# EAGLE schematic PCB_eLock_G592_J1 (EAGLE 6.2)
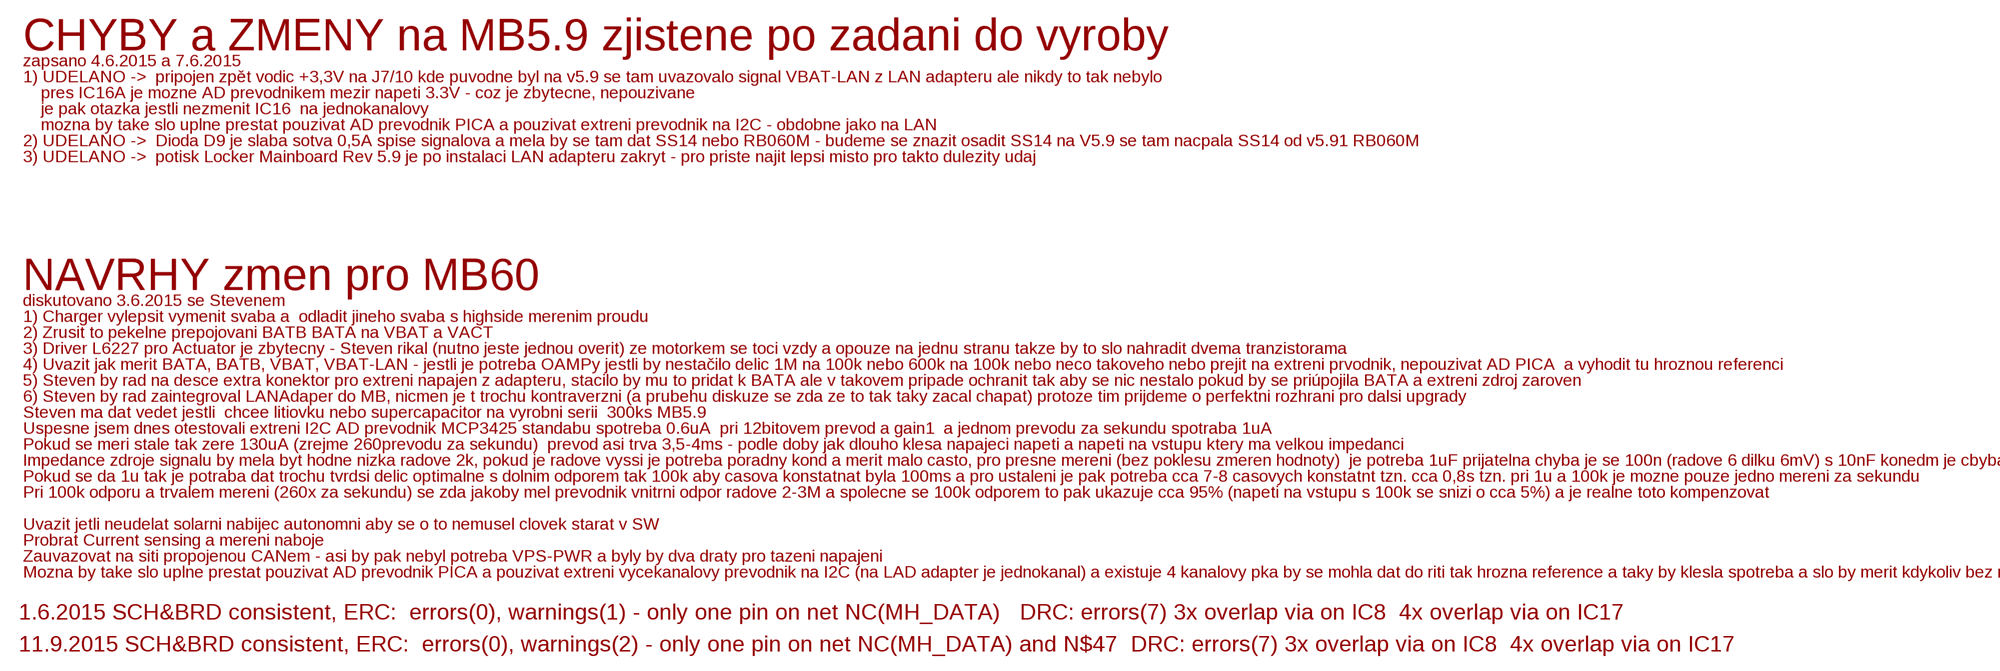
[diagram p0: schematic, sheet 1, part 1 of 3]
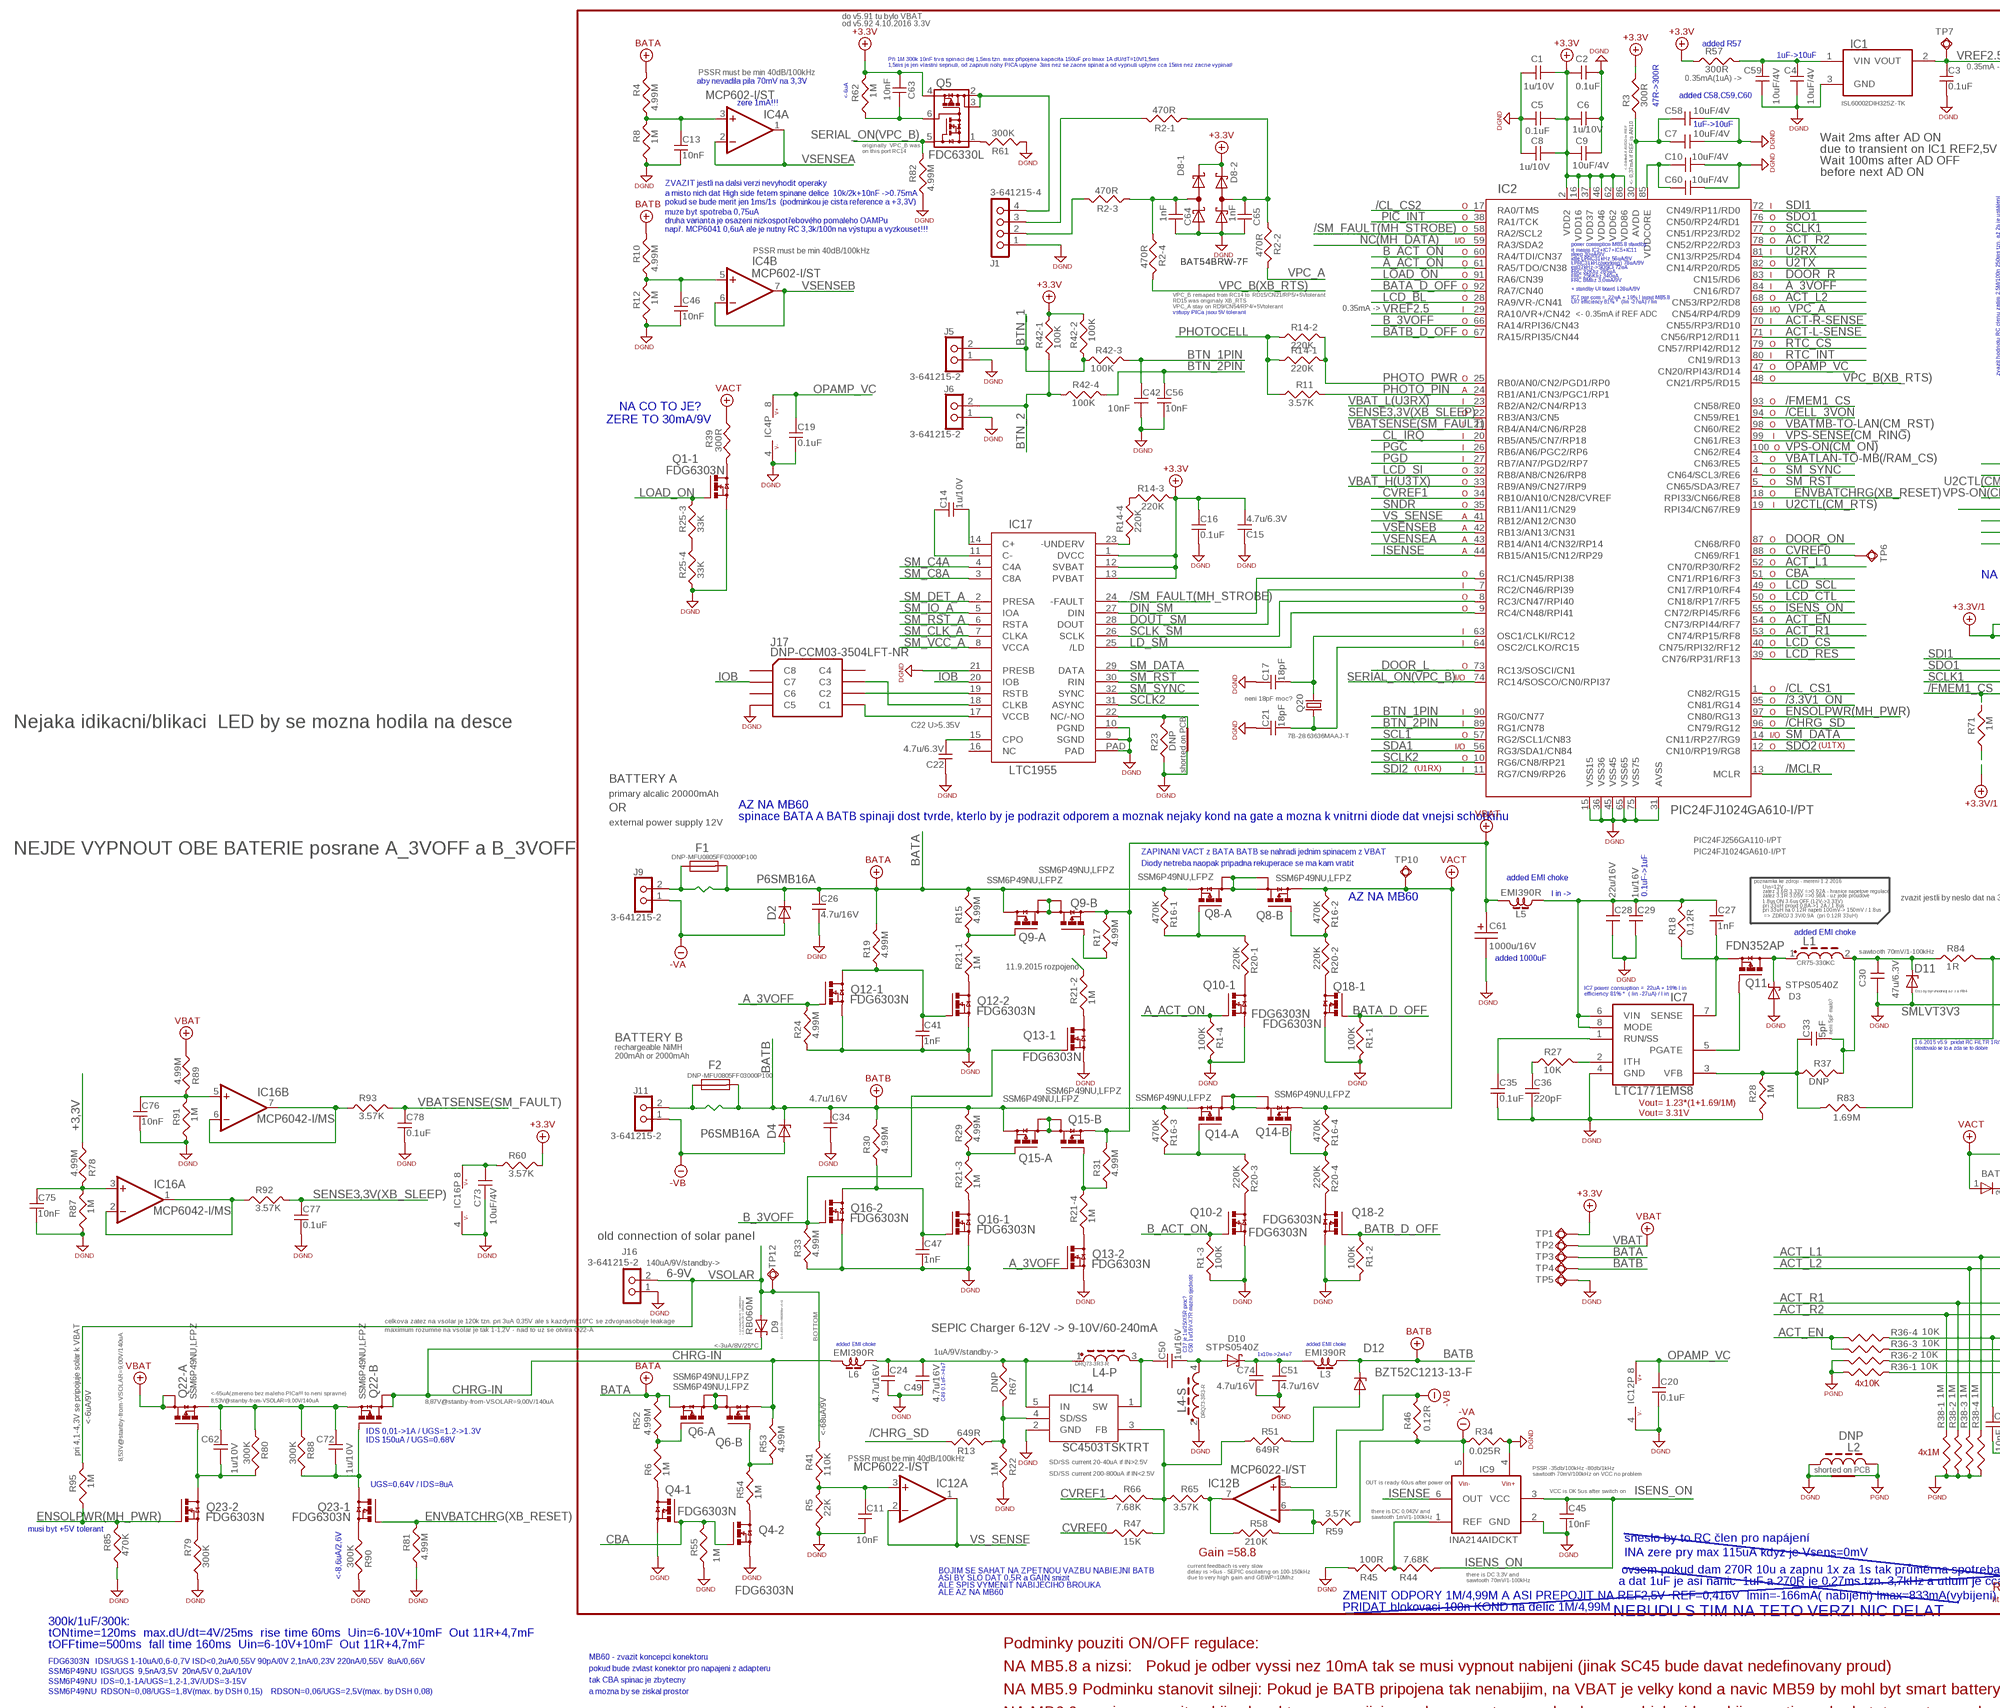
[diagram p1: schematic, sheet 1, part 2 of 3]
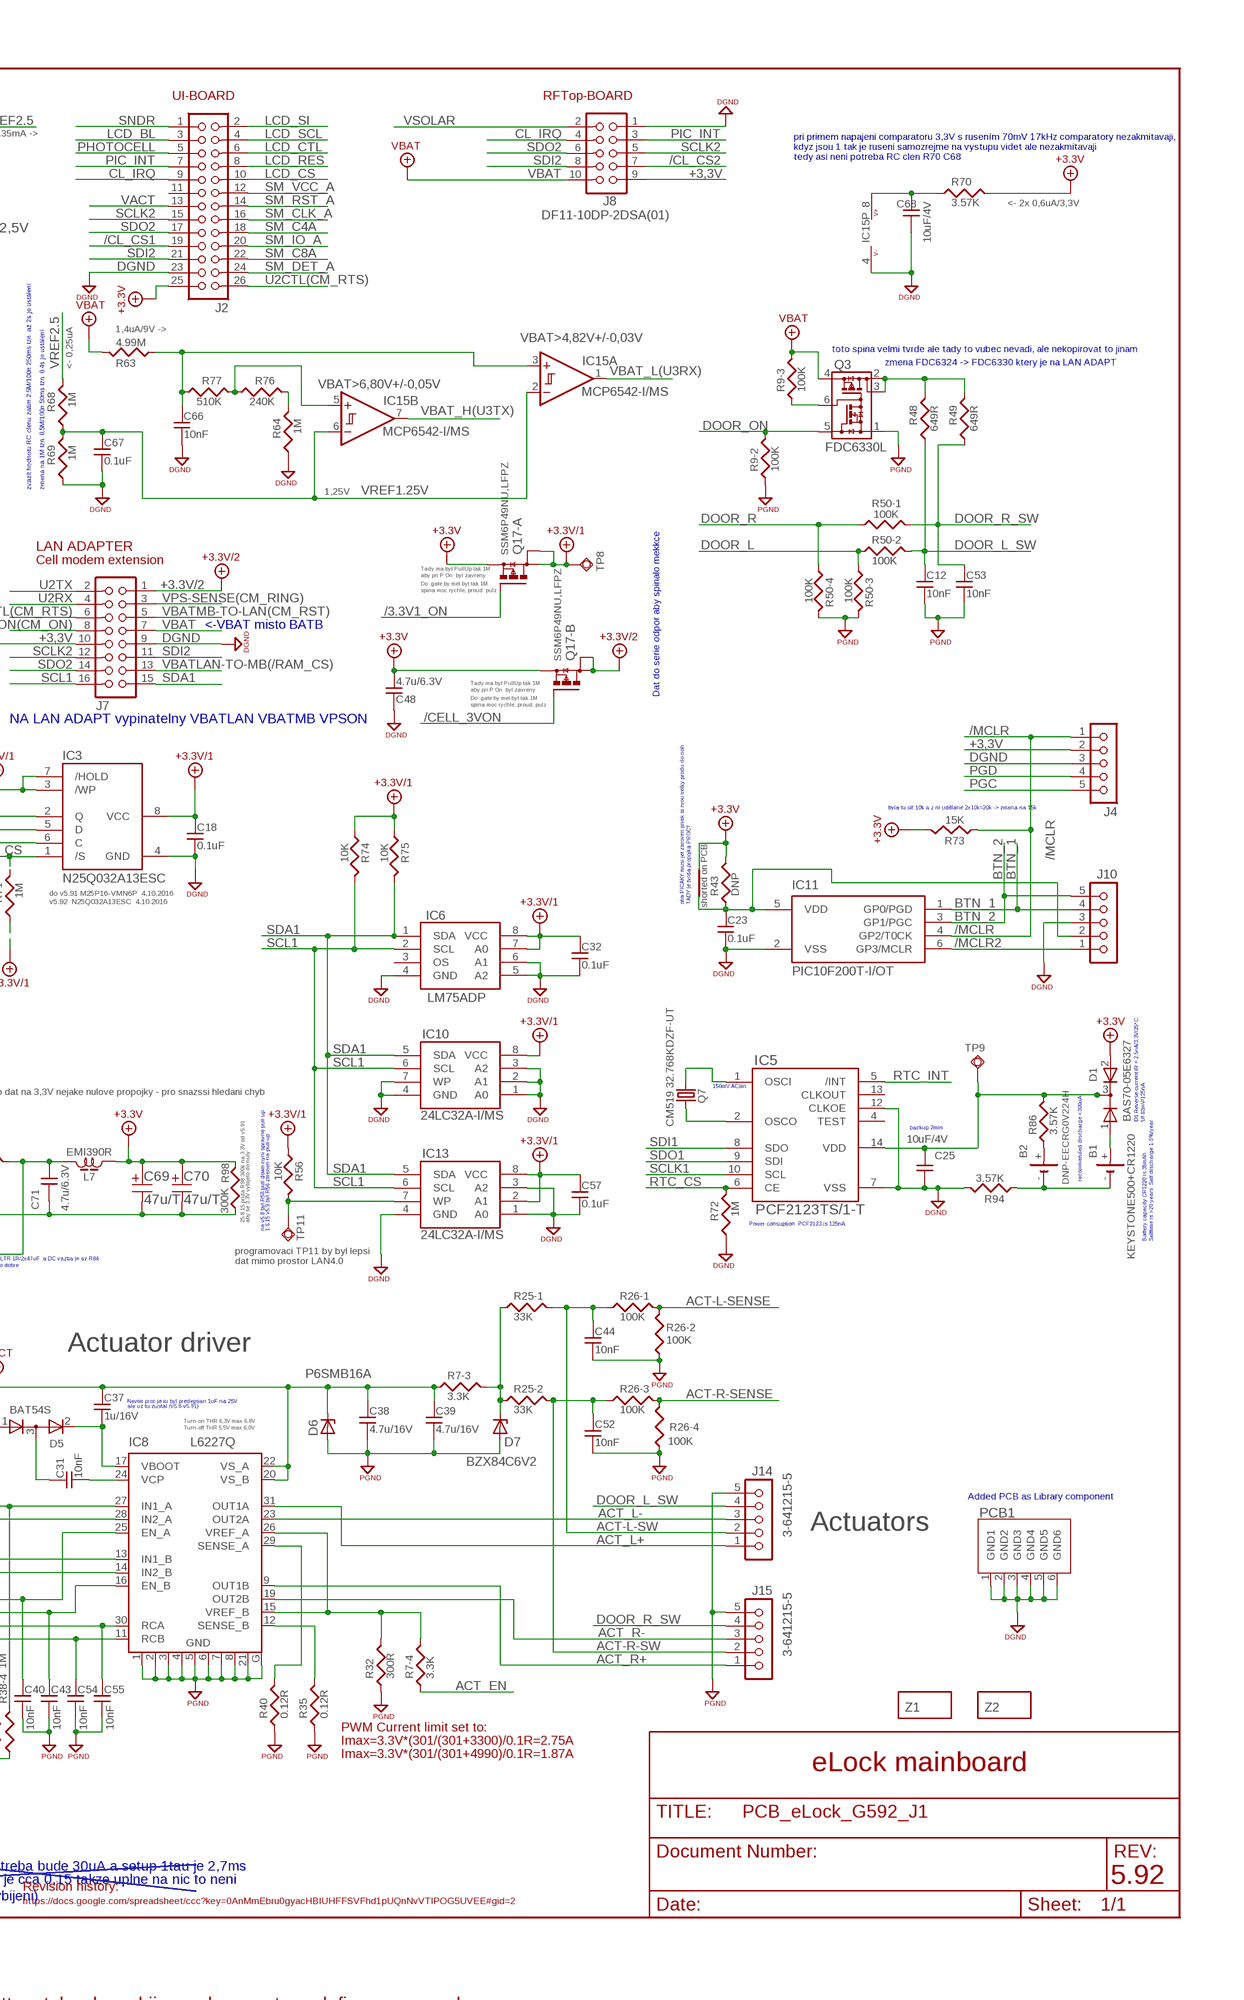
[diagram p2: schematic, sheet 1, part 3 of 3]

## Parts
B1  KEYSTONE500+CR1220  KEYSTONE500  [KEYSTONE500]
B2  DNP-EECRG0V224H  EECRG0V224H  [EECRG0V224H]
C1  1u/10V  C-0603  [0603]
C2  0.1uF  C-0603  [0603]
C3  0.1uF  C-0603  [0603]
C4  10uF/4V  C-0603  [0603]
C5  0.1uF  C-0603  [0603]
C6  1u/10V  C-0603  [0603]
C7  10uF/4V  C-0603  [0603]
C8  1u/10V  C-0603  [0603]
C9  10uF/4V  C-0603  [0603]
C10  10uF/4V  C-0603  [0603]
C11  10nF  C-0603  [0603]
C12  10nF  C-0603  [0603]
C13  10nF  C-0603  [0603]
C14  1u/10V  C-0603  [0603]
C15  4.7u/6.3V  C-0603  [0603]
C16  0.1uF  C-0603  [0603]
C17  18pF  C-0603  [0603]
C18  0.1uF  C-0603  [0603]
C19  0.1uF  C-0603  [0603]
C20  0.1uF  C-0603  [0603]
C21  18pF  C-0603  [0603]
C22  4.7u/6.3V  C-0603  [0603]
C23  0.1uF  C-0603  [0603]
C24  4.7u/16V  C-0805  [0805]
C25  10uF/4V  C-0603  [0603]
C26  4.7u/16V  C-0805  [0805]
C27  1nF  C-0603  [0603]
C28  22u/16V  C-1210  [1210]
C29  1u/16V  C-0603  [0603]
C30  47u/6.3V  C-1210  [1210]
C31  10nF  C-0603  [0603]
C32  0.1uF  C-0603  [0603]
C33  5pF  C-0603  [0603]
C34  4.7u/16V  C-0805  [0805]
C35  0.1uF  C-0603  [0603]
C36  220pF  C-0603  [0603]
C37  1u/16V  C-0603  [0603]
C38  4.7u/16V  C-0805  [0805]
C39  4.7u/16V  C-0805  [0805]
C40  10nF  C-0603  [0603]
C41  1nF  C-0603  [0603]
C42  10nF  C-0603  [0603]
C43  10nF  C-0603  [0603]
C44  10nF  C-0603  [0603]
C45  10nF  C-0603  [0603]
C46  10nF  C-0603  [0603]
C47  1nF  C-0603  [0603]
C48  4.7u/6.3V  C-0603  [0603]
C49  4.7u/16V  C-0805  [0805]
C50  1u/16V  C-0603  [0603]
C51  4.7u/16V  C-0805  [0805]
C52  10nF  C-0603  [0603]
C53  10nF  C-0603  [0603]
C54  10nF  C-0603  [0603]
C55  10nF  C-0603  [0603]
C56  10nF  C-0603  [0603]
C57  0.1uF  C-0603  [0603]
C58  10uF/4V  C-0603  [0603]
C59  10uF/4V  C-0603  [0603]
C60  10uF/4V  C-0603  [0603]
C61  1000u/16V  CE5/13  [CE5/13]
C62  1u/10V  C-0603  [0603]
C63  10nF  C-0603  [0603]
C64  1nF  C-0603  [0603]
C65  1nF  C-0603  [0603]
C66  10nF  C-0603  [0603]
C67  0.1uF  C-0603  [0603]
C68  10uF/4V  C-0603  [0603]
C69  47u/T  CT-C  [CT-C]
C70  47u/T  CT-C  [CT-C]
C71  4.7u/6.3V  C-0603  [0603]
C72  1u/10V  C-0603  [0603]
C73  10uF/4V  C-0603  [0603]
C74  4.7u/16V  C-0805  [0805]
C75  10nF  C-0603  [0603]
C76  10nF  C-0603  [0603]
C77  0.1uF  C-0603  [0603]
C78  0.1uF  C-0603  [0603]
D1  BAS70-05E6327  [SOT-23]
D2  P6SMB16A  [SMB]
D3  STPS0540Z  [SOD-123]
D4  P6SMB16A  [SMB]
D5  BAT54S  [SOT-23]
D6  P6SMB16A  [SMB]
D7  BZX84C6V2  [SOT-23]
D8  BAT54BRW-7F  [SOT-363]
D9  RB060M  MBR0520LT1G  [SOD-123]
D10  STPS0540Z  [SOD-123]
D11  SMLVT3V3  [SMA]
D12  BZT52C1213-13-F  [SOD-123]
F1  DNP-MFU0805FF03000P100  MFU0805FF03000P100  [0805]
F2  DNP-MFU0805FF03000P100  MFU0805FF03000P100  [0805]
IC1  ISL60002DIH325Z-TK  [SOT-23]
IC2  PIC24FJ1024GA610-I/PT  PIC24FJ256GA110-I/PT  [SQFP-S-12X12-100]
IC3  N25Q032A13ESC  M25P16-VMN6P  [SO-08]
IC4  MCP602-I/ST  MCP6022-I/ST  [TSSOP8]
IC5  PCF2123TS/1-T  [TSSOP014]
IC6  LM75ADP  [TSSOP08-3]
IC7  LTC1771EMS8  [MSOP-08]
IC8  L6227Q  [SQFP-S-5X5-32]
IC9  INA214AIDCKT  [SC70-6]
IC10  24LC32A-I/MS  24-I/MS  [MSOP-08]
IC11  PIC10F200T-I/OT  [SOT23-6]
IC12  MCP6022-I/ST  [TSSOP8]
IC13  24LC32A-I/MS  24-I/MS  [MSOP-08]
IC14  SC4503TSKTRT  [SOT23-5]
IC15  MCP6542-I/MS  [MSOP-08]
IC16  MCP6042-I/MS  [MSOP-08]
IC17  LTC1955  [LFCSP_5X5_032]
J1  3-641215-4  [3-641215-4]
J2  PBC13DABN-2x13pinAu-5.8/2.5/5.8  MA13-2  [MA13-2]
J4  DNP  MA05-1  [MA05-1]
J5  3-641215-2  [3-641215-2]
J6  3-641215-2  [3-641215-2]
J7  8x2pin-Au-6/2,5/3  MA08-2  [MA08-2]
J8  DF11-10DP-2DSA(01)  [DF11-10DP-2DSA]
J9  3-641215-2  [3-641215-2]
J10  DNP  MA05-1  [MA05-1]
J11  3-641215-2  [3-641215-2]
J14  3-641215-5  [3-641215-5]
J15  3-641215-5  [3-641215-5]
J16  3-641215-2  [3-641215-2]
J17  DNP-CCM03-3504LFT-NR  CCM03-3504LFT-NR  [CCM03-3504LFT-NR]
L1  CR75-330KC  [CR75]
L2  DNP  L-0805-0R  [0805-0RTOP]
L3  EMI390R  L-1206E  [1206]
L4  DRQ73-3R3-R  DRQ73-100-R  [DRQ73]
L5  EMI390R  L-1206E  [1206]
L6  EMI390R  L-1206E  [1206]
L7  EMI390R  L-1206E  [1206]
PCB1  PCB-MB59  [PCB-MB59]
Q1  FDG6303N  [SC70-6]
Q3  FDC6330L  FDC6324L  [SSOT-6]
Q4  FDG6303N  [SC70-6]
Q5  FDC6330L  FDC6324L  [SSOT-6]
Q6  SSM6P49NU,LFPZ  [MICRO_FET]
Q7  CM519 32.768KDZF-UT  CM519  [CM519]
Q8  SSM6P49NU,LFPZ  [MICRO_FET]
Q9  SSM6P49NU,LFPZ  [MICRO_FET]
Q10  FDG6303N  [SC70-6]
Q11  FDN352AP  [SOT-23]
Q12  FDG6303N  [SC70-6]
Q13  FDG6303N  [SC70-6]
Q14  SSM6P49NU,LFPZ  [MICRO_FET]
Q15  SSM6P49NU,LFPZ  [MICRO_FET]
Q16  FDG6303N  [SC70-6]
Q17  SSM6P49NU,LFPZ  [MICRO_FET]
Q18  FDG6303N  [SC70-6]
Q20  7B-28.63636MAAJ-T  7B-27.120MAAJ-T  [7B]
Q22  SSM6P49NU,LFPZ  [MICRO_FET]
Q23  FDG6303N  [SC70-6]
R1  100K  EXB-38  [0603-ARRAY]
R2  470R  EXB-38  [0603-ARRAY]
R3  300R  R-0603  [0603]
R4  4.99M  R-0603  [0603]
R5  22K  R-0603  [0603]
R6  1M  R-0603  [0603]
R7  3.3K  EXB-38  [0603-ARRAY]
R8  1M  R-0603  [0603]
R9  100K  EXB-38  [0603-ARRAY]
R10  4.99M  R-0603  [0603]
R11  3.57K  R-0603  [0603]
R12  1M  R-0603  [0603]
R13  649R  R-0603  [0603]
R14  220K  EXB-38  [0603-ARRAY]
R15  4.99M  R-0603  [0603]
R16  470K  EXB-38  [0603-ARRAY]
R17  4.99M  R-0603  [0603]
R18  0.12R  R-0805  [0805]
R19  4.99M  R-0603  [0603]
R20  220K  EXB-38  [0603-ARRAY]
R21  1M  EXB-38  [0603-ARRAY]
R22  1M  R-0603  [0603]
R23  DNP  R-0603-0RTOP  [0603-0RTOP]
R24  4.99M  R-0603  [0603]
R25  33K  EXB-38  [0603-ARRAY]
R26  100K  EXB-38  [0603-ARRAY]
R27  10K  R-0603  [0603]
R28  1M  R-0603  [0603]
R29  4.99M  R-0603  [0603]
R30  4.99M  R-0603  [0603]
R31  4.99M  R-0603  [0603]
R32  300R  R-0603  [0603]
R33  4.99M  R-0603  [0603]
R34  0.025R  R-0805  [0805]
R35  0.12R  R-0805  [0805]
R36  10K  EXB-38  [0603-ARRAY]
R37  DNP  R-0603  [0603]
R38  1M  EXB-38  [0603-ARRAY]
R39  300R  R-0603  [0603]
R40  0.12R  R-0805  [0805]
R41  110K  R-0603  [0603]
R42  100K  EXB-38  [0603-ARRAY]
R43  DNP  R-0603-0RTOP  [0603-0RTOP]
R44  7.68K  R-0603  [0603]
R45  100R  R-0603  [0603]
R46  0.12R  R-0805  [0805]
R47  15K  R-0603  [0603]
R48  649R  R-0603  [0603]
R49  649R  R-0603  [0603]
R50  100K  EXB-38  [0603-ARRAY]
R51  649R  R-0603  [0603]
R52  4.99M  R-0603  [0603]
R53  4.99M  R-0603  [0603]
R54  1M  R-0603  [0603]
R55  1M  R-0603  [0603]
R56  10K  R-0603  [0603]
R57  300R  R-0603  [0603]
R58  210K  R-0603  [0603]
R59  3.57K  R-0603  [0603]
R60  3.57K  R-0603  [0603]
R61  300K  R-0603  [0603]
R62  1M  R-0603  [0603]
R63  4.99M  R-0603  [0603]
R64  1M  R-0603  [0603]
R65  3.57K  R-0603  [0603]
R66  7.68K  R-0603  [0603]
R67  DNP  R-0603  [0603]
R68  1M  R-0603  [0603]
R69  1M  R-0603  [0603]
R70  3.57K  R-0603  [0603]
R71  1M  R-0603  [0603]
R72  1M  R-0603  [0603]
R73  15K  R-0603  [0603]
R74  10K  R-0603  [0603]
R75  10K  R-0603  [0603]
R76  240K  R-0603  [0603]
R77  510K  R-0603  [0603]
R78  4.99M  R-0603  [0603]
R79  300K  R-0603  [0603]
R80  300K  R-0603  [0603]
R81  4.99M  R-0603  [0603]
R82  4.99M  R-0603  [0603]
R83  1.69M  R-0603  [0603]
R84  1R  R-0805  [0805]
R85  470K  R-0603  [0603]
R86  3.57K  R-0603  [0603]
R87  1M  R-0603  [0603]
R88  300K  R-0603  [0603]
R89  4.99M  R-0603  [0603]
R90  300K  R-0603  [0603]
R91  1M  R-0603  [0603]
R92  3.57K  R-0603  [0603]
R93  3.57K  R-0603  [0603]
R94  3.57K  R-0603  [0603]
R95  1M  R-0603  [0603]
R98  300K  R-0603  [0603]
TP1  DNP-TestPoint  ROUND_SMD1MM  [SMD_ROUND_1MM]
TP2  DNP-TestPoint  ROUND_SMD1MM  [SMD_ROUND_1MM]
TP3  DNP-TestPoint  DNP-TESTPOINT1MM  [SMD_ROUND_1MM]
TP4  DNP-TestPoint  DNP-TESTPOINT1MM  [SMD_ROUND_1MM]
TP5  DNP-TestPoint  ROUND_SMD1MM  [SMD_ROUND_1MM]
TP6  DNP-TestPoint  ROUND_SMD1MM  [SMD_ROUND_1MM]
TP7  DNP-TestPoint  ROUND_SMD1MM  [SMD_ROUND_1MM]
TP8  DNP-TestPoint  ROUND_SMD1MM  [SMD_ROUND_1MM]
TP9  DNP-TestPoint  ROUND_SMD1MM  [SMD_ROUND_1MM]
TP10  DNP-TestPoint  ROUND_SMD1MM  [SMD_ROUND_1MM]
TP11  DNP-TestPoint  ROUND_SMD1MM  [SMD_ROUND_1MM]
TP12  DNP-TestPoint  ROUND_SMD1MM  [SMD_ROUND_1MM]
Z1  DNP-FiducialMark  REF  [REF]
Z2  DNP-FiducialMark  REF  [REF]

## Nets
3.3V-CMP-FILTERED: C68.1 IC15.8(P:V+) R70.1
+3,3V: C1.1 C2.1 C5.1 C6.1 C8.1 C9.1 C15.2 C16.1 C48.2 C63.1 C69.+ C70.+ D1.2(A2) D8.4(-2:K) D8.5(-1:K) IC2.2(VDD2) IC2.16(VDD16) IC2.37(VDD37) IC2.46(VDD46) IC2.62(VDD62) IC2.86(VDD86) IC17.1(DVCC) IC17.12(SVBAT) IC17.13(PVBAT) J2.25 J4.2 J7.10 J8.9 L7.2 Q5.4(Q2S) Q17.1(-A:S) Q17.4(-B:S) R3.2 R14.3 R42.7 R42.8 R43.2 R57.1 R60.2 R62.1 R70.2 R73.2 R78.2 R98.1 TP1.P$1(TP) ; supply symbol labelled +3.3V
+3.3V/1: C18.1 C32.1 C57.1 IC3.3(/WP) IC3.7(/HOLD) IC3.8(VCC) IC6.7(A0) IC6.8(VCC) IC10.8(VCC) IC13.2(A1) IC13.8(VCC) Q17.6(-A:D) Q17.P1(-A:D1) R56.1 R71.2 R74.1 R75.1 TP8.P$1(TP)
+3.3V/2: J7.1 Q17.3(-B:D) Q17.P2(-B:D1)
-VA: D2.A IC9.5(VIN-) J9.1 R34.1 R46.1 R59.2
-VB: D4.A IC12.5(B:+IN) J11.1 R46.2
/3.3V1_ON: IC2.95(CN81/RG14) Q17.2(-A:G)
/CELL_3VON: IC2.94(CN59/RE1) Q17.5(-B:G)
/CHRG_SD: IC2.96(CN79/RG12) R13.1
/CL_CS1: IC2.1(CN82/RG15) J2.19
/CL_CS2: IC2.17(RA0/TMS) J8.7
/FMEM1_CS: IC2.93(CN58/RE0) IC3.1(/S) R71.1
/MCLR: IC2.13(MCLR) IC11.4(GP2/T0CK) J4.1 R73.1
/MCLR2: IC11.6(GP3/MCLR) J10.1
/SM_FAULT(MH_STROBE): IC2.58(RA2/SCL2) IC17.24(-FAULT)
A_3VOFF: IC2.84(CN16/RD7) Q12.2(-1:G) Q13.5(-2:G) R24.2
A_ACT_ON: IC2.61(RA5/TDO/CN38) Q10.2(-1:G) R1.4
ACT-L-SENSE: IC2.71(CN56/RP12/RD11) R26.7 R26.8
ACT-L-SW: C44.1 J14.2 R25.8 R26.1
ACT-R-SENSE: IC2.70(CN55/RP3/RD10) R26.5 R26.6
ACT-R-SW: C52.1 J15.2 R25.7 R26.3
ACT_EN: IC2.54(CN73/RPI44/RF7) R7.4 R36.5 R36.6
ACT_L1: IC2.52(CN70/RP30/RF2) IC8.27(IN1_A) R38.5
ACT_L2: IC2.68(CN53/RP2/RD8) IC8.28(IN2_A) R38.6
ACT_L+: IC8.31(OUT1A) J14.1
ACT_L-: IC8.23(OUT2A) J14.3
ACT_R1: IC2.53(CN74/RP15/RF8) IC8.13(IN1_B) R38.7
ACT_R2: IC2.78(CN52/RP22/RD3) IC8.14(IN2_B) R38.8
ACT_R+: IC8.9(OUT1B) J15.1
ACT_R-: IC8.19(OUT2B) J15.3
AVDD: C7.1 C58.1 IC2.30(AVDD) R3.1
B_3VOFF: IC2.66(RA14/RPI36/CN43) Q13.2(-1:G) Q16.5(-2:G) R33.2
B_ACT_ON: IC2.60(RA4/TDI/CN37) Q10.5(-2:G) R1.6
BATA: C26.1 D2.C F1.1 F1.2 J9.2 Q6.1(-A:S) Q8.1(-A:S) Q9.1(-A:S) R4.1 R15.2 R16.1 R19.2 R52.2 TP3.P$1(TP)
BATA_D_OFF: IC2.92(RA7/CN40) Q18.2(-1:G) R1.1
BATB: C34.1 D4.C D12.1+(C) F2.1 F2.2 J11.2 L3.2 Q14.1(-A:S) Q15.1(-A:S) R10.1 R16.3 R29.2 R30.2 TP4.P$1(TP)
BATB_D_OFF: IC2.67(RA15/RPI35/CN44) Q18.5(-2:G) R1.2
BTN_1: IC11.1(GP0/PGD) J5.2 J10.4 R42.2 R42.3
BTN_1PIN: C42.1 IC2.90(RG0/CN77) R42.6
BTN_2: IC11.3(GP1/PGC) J6.2 J10.5 R42.1 R42.4
BTN_2PIN: C56.1 IC2.89(RG1/CN78) R42.5
CBA: IC2.51(CN71/RP16/RF3) Q4.2(-1:G) Q4.5(-2:G) R55.2
CHRG-IN: D9.K L6.1 Q6.4(-B:S) Q22.3(-B:D) Q22.P2(-B:D1) R53.2
CL_IRQ: IC2.20(RB5/AN5/CN7/RP18) J2.9 J8.4
CMP-HI-LEVEL: IC15.5(B:+IN) R76.2 R77.1
CMP-LO-LEVEL: C66.1 IC15.3(A:+IN) R63.2 R77.2
CVREF0: IC2.88(CN69/RF1) R47.2 TP6.P$1(TP)
CVREF1: IC2.34(RB10/AN10/CN28/CVREF) R66.2
DGND: C1.2 C2.2 C3.2 C4.2 C5.2 C6.2 C7.2 C8.2 C9.2 C10.1 C11.2 C13.2 C15.1 C16.2 C17.1 C18.2 C19.2 C20.2 C21.1 C22.1 C23.2 C24.2 C25.2 C26.2 C28.2 C29.2 C30.2 C32.2 C34.2 C35.2 C36.2 C41.2 C42.2 C45.2 C46.2 C47.2 C48.1 C49.2 C51.2 C56.2 C57.2 C58.2 C59.2 C60.1 C61.- C64.2 C65.2 C66.2 C67.2 C68.2 C69.- C70.- C71.2 C73.2 C74.2 C75.2 C76.2 C77.2 C78.2 D3.A D8.1(-1:A) D8.2(-2:A) D11.-(A) IC1.3(GND) IC2.15(VSS15) IC2.31(AVSS) IC2.36(VSS36) IC2.45(VSS45) IC2.65(VSS65) IC2.75(VSS75) IC3.4(GND) IC4.4(P:V-) IC5.7(VSS) IC5.12(CLKOE) IC6.4(GND) IC6.5(A2) IC6.6(A1) IC7.4(GND) IC9.2(GND) IC9.4(VIN+) IC10.1(A0) IC10.2(A1) IC10.3(A2) IC10.4(GND) IC10.7(WP) IC11.2(VSS) IC12.4(P:V-) IC13.1(A0) IC13.3(A2) IC13.4(GND) IC14.2(GND) IC15.4(P:V-) IC16.4(P:V-) IC17.9(SGND) IC17.10(PGND) IC17.21(PRESB) IC17.PAD J1.1 J2.23 J4.3 J5.1 J6.1 J7.9 J8.1 J10.3 J16.1 J17.C5 L2.2 L4.2 PCB1.1(GND1) PCB1.2(GND2) PCB1.3(GND3) PCB1.4(GND4) PCB1.5(GND5) PCB1.6(GND6) Q1.1(-1:S) Q4.1(-1:S) Q4.4(-2:S) Q10.1(-1:S) Q10.4(-2:S) Q12.1(-1:S) Q12.4(-2:S) Q13.1(-1:S) Q13.4(-2:S) Q16.1(-1:S) Q16.4(-2:S) Q18.1(-1:S) Q18.4(-2:S) R1.3 R1.5 R1.7 R1.8 R5.2 R8.2 R12.2 R22.1 R23.1 R24.1 R25.4 R28.2 R33.1 R34.2 R45.1 R55.1 R61.2 R64.2 R69.2 R72.2 R79.1 R81.2 R82.2 R85.2 R87.2 R90.1 R91.2 R94.2 R98.2 TP5.P$1(TP)
DIN_SM: IC2.6(RC1/CN45/RPI38) IC17.27(DIN)
DOOR_L: IC2.73(RC13/SOSCI/CN1) R50.2 R50.3
DOOR_L_SW: C12.1 J14.4 R48.2 R50.7
DOOR_ON: IC2.87(CN68/RF0) Q3.5(Q1G) R9.7
DOOR_R: IC2.83(CN15/RD6) R50.1 R50.4
DOOR_R_SW: C53.1 J15.4 R49.2 R50.8
DOUT_SM: IC2.7(RC2/CN46/RPI39) IC17.28(DOUT)
ENSOLPWR(MH_PWR): IC2.97(CN80/RG13) Q23.5(-2:G) R85.1 R95.2
ENVBATCHRG(XB_RESET): IC2.18(RPI33/CN66/RE8) Q23.2(-1:G) R81.1
IOB: IC17.20(IOB) J17.C7
IREF: IC9.1(REF) R44.1 R45.2
ISENS_ON: C45.1 IC2.55(CN72/RPI45/RF6) IC9.3(VCC) R44.2
ISENSE: IC2.44(RB15/AN15/CN12/RP29) IC9.6(OUT)
LCD_BL: IC2.28(RA9/VR-/CN41) J2.3
LCD_CS: IC2.40(CN75/RPI32/RF12) J2.10
LCD_CTL: IC2.50(CN18/RP17/RF5) J2.6
LCD_RES: IC2.39(CN76/RP31/RF13) J2.8
LCD_SCL: IC2.49(CN17/RP10/RF4) J2.4
LCD_SI: IC2.32(RB8/AN8/CN26/RP8) J2.2
LD_SM: IC2.9(RC4/CN48/RPI41) IC17.25(/LD)
LOAD_ON: IC2.91(RA6/CN39) Q1.2(-1:G) R25.6
N$1: B1.- B2.- R94.1
N$2: C22.2 IC17.15(CPO)
N$3: B1.+ D1.1(A1)
N$4: Q18.6(-1:D) R20.7
N$5: C4.1 C59.1 IC1.1(VIN) R57.2
N$6: C31.2 IC8.24(VCP)
N$7: IC17.19(RSTB) J17.C2
N$8: C21.2 IC2.64(OSC2/CLKO/RC15) Q20.1
N$9: Q8.3(-B:D) Q8.6(-A:D) Q8.P1(-A:D1) Q8.P2(-B:D1)
N$10: Q14.3(-B:D) Q14.6(-A:D) Q14.P1(-A:D1) Q14.P2(-B:D1)
N$11: R25.3 R25.5
N$12: C13.1 IC4.3(A:+IN) R4.2 R8.1
N$13: C14.1 IC17.11(C-)
N$14: C14.2 IC17.14(C+)
N$15: C46.1 IC4.5(B:+IN) R10.2 R12.1
N$16: C25.1 D1.3(K) IC5.14(VDD) R86.2 TP9.P$1(TP)
N$17: Q10.6(-1:D) R20.8
N$18: IC17.23(-UNDERV) R14.4
N$19: C31.1 D5.3(KA)
N$20: Q10.3(-2:D) R20.6
N$21: C33.1 IC7.3(VFB) R28.1 R37.2 R83.2
N$22: IC5.1(OSCI) Q7.2
N$23: IC5.2(OSCO) Q7.1
N$24: Q14.5(-B:G) R16.5 R20.4
N$25: IC17.22(NC/-NO) R23.2
N$26: Q18.3(-2:D) R20.5
N$27: Q8.5(-B:G) R16.7 R20.2
N$28: IC17.18(CLKB) J17.C3
N$29: D7.3(C) R7.6 R25.1 R25.2
N$30: D12.2(A) R51.1
N$31: IC8.12(SENSE_B) R35.2
N$32: Q1.6(-1:D) R39.1
N$33: IC14.4(SD/SS) R13.2 R22.2 R67.1
N$34: IC17.17(VCCB) J17.C1
N$35: Q3.6(Q2G) R9.3
N$36: C17.2 IC2.63(OSC1/CLKI/RC12) Q20.3
N$37: C30.1 C33.2 D11.+(C) L1.2 R37.1 R84.1
N$38: Q8.2(-A:G) R16.8 R20.1
N$39: Q6.2(-A:G) R6.2 R52.1
N$40: Q3.2(Q2D1) Q3.3(Q2D2) R48.1 R49.1
N$41: IC8.29(SENSE_A) R40.2
N$42: Q14.2(-A:G) R16.6 R20.3
N$43: C23.1 IC11.5(VDD) J10.2 R43.1
N$44: R14.5 R14.6
N$45: Q6.3(-B:D) Q6.6(-A:D) Q6.P1(-A:D1) Q6.P2(-B:D1)
N$46: Q6.5(-B:G) R53.1 R54.2
N$47: C37.2 D5.2(K) IC8.17(VBOOT)
N$48: Q4.6(-1:D) R6.1
N$49: R21.7
N$50: Q9.2(-A:G) R15.1 R21.8
N$51: C54.1 IC8.11(RCB) R36.1
N$52: Q15.2(-A:G) R21.6 R29.1
N$53: Q4.3(-2:D) R54.1
N$54: Q12.3(-2:D) R21.1
N$55: C41.1 Q12.5(-2:G) Q12.6(-1:D) R19.1
N$56: IC13.7(WP) R56.2 TP11.P$1(TP)
N$57: IC12.6(B:-IN) R58.1 R59.1
N$58: Q13.6(-1:D) R21.2
N$59: C47.1 Q16.2(-1:G) Q16.3(-2:D) R30.1
N$60: C40.1 IC8.25(EN_A) R36.4
N$61: Q9.3(-B:D) Q9.6(-A:D) Q9.P1(-A:D1) Q9.P2(-B:D1)
N$62: R64.1 R76.1
N$63: Q15.3(-B:D) Q15.6(-A:D) Q15.P1(-A:D1) Q15.P2(-B:D1)
N$64: Q23.4(-2:S) R79.2
N$65: C71.1 L7.1 R83.1 R84.2
N$66: J1.4 Q5.2(Q2D1) Q5.3(Q2D2)
N$67: C63.2 Q5.6(Q2G) R62.2
N$68: J1.2 R2.6
N$69: Q5.1(Q1S) R61.1
N$70: C43.1 IC8.16(EN_B) R36.3
N$71: C55.1 IC8.30(RCA) R36.2
N$72: C62.2 Q22.2(-A:G) Q23.3(-2:D) R80.2
N$73: C50.1 IC14.1(SW) L4.3
N$74: C64.1 D8.6(-1:AK) R2.3 R2.4
N$75: IC7.5(PGATE) Q11.1(G)
N$76: C50.2 D10.A L4.4
N$77: IC7.2(ITH) R27.2
N$78: IC8.15(VREF_B) IC8.26(VREF_A) R7.5 R32.2
N$79: C36.1 R27.1
N$80: C35.1 IC7.1(RUN/SS)
N$81: IC14.3(FB) R47.1 R51.2 R65.2 R66.1
N$82: C27.2 IC7.7(SENSE) Q11.2(S) R18.1
N$83: D3.C(K) L1.1 Q11.3(D)
N$84: C62.1 C72.1 Q22.1(-A:S) Q22.4(-B:S) R80.1 R88.1
N$85: J1.3 R2.8
N$86: C65.1 D8.3(-2:AK) R2.1 R2.2
N$87: B2.+ R86.1
N$91: C75.1 IC16.3(A:+IN) R78.1 R87.1
N$92: C72.2 Q22.5(-B:G) Q23.6(-1:D) R88.2
N$93: C51.1 C74.1 D10.C(K) L3.1
N$94: Q23.1(-1:S) R90.2
N$95: Q16.6(-1:D) R21.3
N$96: Q13.3(-2:D) R21.4
N$97: C27.1 C28.1 C29.1 IC7.6(VIN) IC7.8(MODE) L5.2 R18.2
N$98: C11.1 IC12.3(A:+IN) R5.1 R41.2
N$99: C24.1 C49.1 IC14.5(IN) L4.1 L6.2 R67.2
N$100: IC16.1(A:OUT) IC16.2(A:-IN) R92.1
N$101: Q9.5(-B:G) R17.1
N$102: C73.1 IC16.8(P:V+) R60.1
N$103: C76.1 IC16.5(B:+IN) R89.1 R91.1
N$104: Q15.5(-B:G) R21.5 R31.1
N$105: IC16.6(B:-IN) IC16.7(B:OUT) R93.1
NC(MH_DATA): IC2.59(RA3/SDA2)
OPAMP_VC: C19.1 C20.1 IC2.47(CN20/RPI43/RD14) IC4.8(P:V+) IC12.8(P:V+)
PGC: IC2.26(RB6/AN6/PGC2/RP6) J4.5
PGD: IC2.27(RB7/AN7/PGD2/RP7) J4.4
PGND: C12.2 C38.2 C39.2 C40.2 C43.2 C44.2 C52.2 C53.2 C54.2 C55.2 D6.A D7.1(A) IC8.1(GND1) IC8.2(GND2) IC8.3(GND3) IC8.4(GND4) IC8.5(GND5) IC8.6(GND6) IC8.7(GND7) IC8.8(GND8) IC8.21(GND21) IC8.G(GNEXP) J14.5 J15.5 L2.1 Q3.1(Q1S) R9.2 R26.2 R26.4 R32.1 R35.1 R36.7 R36.8 R38.1 R38.2 R38.3 R38.4 R40.1 R50.5 R50.6
PHOTO_PIN: IC2.24(RB1/AN1/CN3/PGC1/RP1) R11.1
PHOTO_PWR: IC2.25(RB0/AN0/CN2/PGD1/RP0) R14.7 R14.8
PHOTOCELL: J2.5 R11.2 R14.1 R14.2
PIC_INT: IC2.38(RA1/TCK) J2.7 J8.3
RTC_CS: IC2.79(CN57/RPI42/RD12) IC5.6(CE) R72.1
RTC_INT: IC2.80(CN19/RD13) IC5.5(/INT)
SCL1: IC2.57(RG2/SCL1/CN83) IC6.2(SCL) IC10.6(SCL) IC13.6(SCL) J7.16 R74.2
SCLK1: IC2.77(CN51/RP23/RD2) IC3.6(C) IC5.10(SCL)
SCLK2: IC2.10(RG6/CN8/RP21) IC17.31(ASYNC) J2.15 J7.12 J8.5
SCLK_SM: IC2.8(RC3/CN47/RPI40) IC17.26(SCLK)
SDA1: IC2.56(RG3/SDA1/CN84) IC6.1(SDA) IC10.5(SDA) IC13.5(SDA) J7.15 R75.2
SDI1: IC2.72(CN49/RP11/RD0) IC3.2(Q) IC5.8(SDO)
SDI2: IC2.11(RG7/CN9/RP26) J2.21 J7.11 J8.8
SDO1: IC2.76(CN50/RP24/RD1) IC3.5(D) IC5.9(SDI)
SDO2: IC2.12(CN10/RP19/RG8) J2.17 J7.14 J8.6
SENSE3,3V(XB_SLEEP): C77.1 IC2.22(RB3/AN3/CN5) R92.2
SERIAL_ON(VPC_B): IC2.74(RC14/SOSCO/CN0/RPI37) Q5.5(Q1G) R82.1
SM_C4A: IC17.4(C4A) J2.18
SM_C8A: IC17.3(C8A) J2.22
SM_CLK_A: IC17.7(CLKA) J2.16
SM_DATA: IC2.14(CN11/RP27/RG9) IC17.29(DATA)
SM_DET_A: IC17.2(PRESA) J2.24
SM_IO_A: IC17.5(IOA) J2.20
SM_RST: IC2.5(CN65/SDA3/RE7) IC17.30(RIN)
SM_RST_A: IC17.6(RSTA) J2.14
SM_SYNC: IC2.4(CN64/SCL3/RE6) IC17.32(SYNC)
SM_VCC_A: IC17.8(VCCA) J2.12
SNDR: IC2.35(RB11/AN11/CN29) J2.1
U2CTL(CM_RTS): IC2.19(RPI34/CN67/RE9) J2.26 J7.6
U2RX: IC2.81(CN13/RP25/RD4) J7.4
U2TX: IC2.82(CN14/RP20/RD5) J7.2
V-ISEN: IC12.7(B:OUT) R58.2 R65.1
VACT: C37.1 C38.1 C39.1 D5.1(A) D6.C IC8.20(VS_B) IC8.22(VS_A) J2.13 Q8.4(-B:S) Q14.4(-B:S) R7.3 R16.2 R16.4 R39.2 TP10.P$1(TP)
VBAT: C61.+ J7.7 J8.10 L5.1 Q3.4(Q2S) Q9.4(-B:S) Q15.4(-B:S) Q22.6(-A:D) Q22.P1(-A:D1) R9.6 R17.2 R31.2 R63.1 R89.2 TP2.P$1(TP)
VBAT_H(U3TX): IC2.33(RB9/AN9/CN27/RP9) IC15.7(B:OUT)
VBAT_L(U3RX): IC2.23(RB2/AN2/CN4/RP13) IC15.1(A:OUT)
VBATLAN-TO-MB(/RAM_CS): IC2.3(CN63/RE5) J7.13
VBATMB-TO-LAN(CM_RST): IC2.98(CN60/RE2) J7.5
VBATSENSE(SM_FAULT): C78.1 IC2.21(RB4/AN4/CN6/RP28) R93.2
VDDCOE: C10.2 C60.2 IC2.85(VDDCORE)
VPC_A: IC2.69(CN54/RP4/RD9) R2.7
VPC_B(XB_RTS): IC2.48(CN21/RP5/RD15) R2.5
VPS-ON(CM_ON): IC2.100(CN62/RE4) J7.8
VPS-SENSE(CM_RING): IC2.99(CN61/RE3) J7.3
VREF1.25V: C67.1 IC15.2(A:-IN) IC15.6(B:-IN) R68.2 R69.1
VREF2.5: C3.1 IC1.2(VOUT) IC2.29(RA10/VR+/CN42) R68.1 TP7.P$1(TP)
VS_SENSE: IC2.41(RB12/AN12/CN30) IC12.1(A:OUT) IC12.2(A:-IN)
VSENSEA: IC2.43(RB14/AN14/CN32/RP14) IC4.1(A:OUT) IC4.2(A:-IN)
VSENSEB: IC2.42(RB13/AN13/CN31) IC4.6(B:-IN) IC4.7(B:OUT)
VSOLAR: D9.A J8.2 J16.2 R41.1 R95.1 TP12.P$1(TP)
Unconnected: IC5.4(TEST) IC5.13(CLKOUT) IC6.3(OS) IC17.16(NC) J2.11 J17.C4 J17.C6 J17.C8 Q1.3(-2:D) Q1.4(-2:S) Q1.5(-2:G) R7.1 R7.2 R7.7 R7.8 R9.1 R9.4 R9.5 R9.8

## Notes on the sheet
- CHYBY a ZMENY na MB5.9 zjistene po zadani do vyroby
- zapsano 4.6.2015 a 7.6.2015
- 1) UDELANO ->  pripojen zpět vodic +3,3V na J7/10 kde puvodne byl na v5.9 se tam uvazovalo signal VBAT-LAN z LAN adapteru ale nikdy to tak nebylo
- pres IC16A je mozne AD prevodnikem mezir napeti 3.3V - coz je zbytecne, nepouzivane
- je pak otazka jestli nezmenit IC16  na jednokanalovy
- mozna by take slo uplne prestat pouzivat AD prevodnik PICA a pouzivat extreni prevodnik na I2C - obdobne jako na LAN
- 2) UDELANO ->  Dioda D9 je slaba sotva 0,5A spise signalova a mela by se tam dat SS14 nebo RB060M - budeme se znazit osadit SS14 na V5.9 se tam nacpala SS14 od v5.91 RB060M
- 3) UDELANO ->  potisk Locker Mainboard Rev 5.9 je po instalaci LAN adapteru zakryt - pro priste najit lepsi misto pro takto dulezity udaj
- NAVRHY zmen pro MB60
- diskutovano 3.6.2015 se Stevenem
- 1) Charger vylepsit vymenit svaba a  odladit jineho svaba s highside merenim proudu
- 2) Zrusit to pekelne prepojovani BATB BATA na VBAT a VACT
- 3) Driver L6227 pro Actuator je zbytecny - Steven rikal (nutno jeste jednou overit) ze motorkem se toci vzdy a opouze na jednu stranu takze by to slo nahradit dvema tranzistorama
- 4) Uvazit jak merit BATA, BATB, VBAT, VBAT-LAN - jestli je potreba OAMPy jestli by nestačilo delic 1M na 100k nebo 600k na 100k nebo neco takoveho nebo prejit na extreni prvodnik, nepouzivat AD PICA  a vyhodit tu hroznou referenci
- 5) Steven by rad na desce extra konektor pro extreni napajen z adapteru, stacilo by mu to pridat k BATA ale v takovem pripade ochranit tak aby se nic nestalo pokud by se priúpojila BATA a extreni zdroj zaroven
- 6) Steven by rad zaintegroval LANAdaper do MB, nicmen je t trochu kontraverzni (a prubehu diskuze se zda ze to tak taky zacal chapat) protoze tim prijdeme o perfektni rozhrani pro dalsi upgrady
- Steven ma dat vedet jestli  chcee litiovku nebo supercapacitor na vyrobni serii  300ks MB5.9
- Uspesne jsem dnes otestovali extreni I2C AD prevodnik MCP3425 standabu spotreba 0.6uA  pri 12bitovem prevod a gain1  a jednom prevodu za sekundu spotraba 1uA
- Pokud se meri stale tak zere 130uA (zrejme 260prevodu za sekundu)  prevod asi trva 3,5-4ms - podle doby jak dlouho klesa napajeci napeti a napeti na vstupu ktery ma velkou impedanci
- Impedance zdroje signalu by mela byt hodne nizka radove 2k, pokud je radove vyssi je potreba poradny kond a merit malo casto, pro presne mereni (bez poklesu zmeren hodnoty)  je potreba 1uF prijatelna chyba je se 100n (radove 6 dilku 6mV) s 10nF konedm je cbyba uz velmi velka radove 70mV pri napeti 544mV (cca 1/4 rozsahu) takze 10n je neprijatelne malo
- Pokud se da 1u tak je potraba dat trochu tvrdsi delic optimalne s dolnim odporem tak 100k aby casova konstatnat byla 100ms a pro ustaleni je pak potreba cca 7-8 casovych konstatnt tzn. cca 0,8s tzn. pri 1u a 100k je mozne pouze jedno mereni za sekundu
- Pri 100k odporu a trvalem mereni (260x za sekundu) se zda jakoby mel prevodnik vnitrni odpor radove 2-3M a spolecne se 100k odporem to pak ukazuje cca 95% (napeti na vstupu s 100k se snizi o cca 5%) a je realne toto kompenzovat
- Uvazit jetli neudelat solarni nabijec autonomni aby se o to nemusel clovek starat v SW
- Probrat Current sensing a mereni naboje
- Zauvazovat na siti propojenou CANem - asi by pak nebyl potreba VPS-PWR a byly by dva draty pro tazeni napajeni
- Mozna by take slo uplne prestat pouzivat AD prevodnik PICA a pouzivat extreni vycekanalovy prevodnik na I2C (na LAD adapter je jednokanal) a existuje 4 kanalovy pka by se mohla dat do riti tak hrozna reference a taky by klesla spotreba a slo by merit kdykoliv bez nutnosti zapinat zravy AD modul nicmene by se musela poresit I2C, ktera je totiz vazana na 3,3V/1
- 1.6.2015 SCH&BRD consistent, ERC:  errors(0), warnings(1) - only one pin on net NC(MH_DATA)   DRC: errors(7) 3x overlap via on IC8  4x overlap via on IC17
- 11.9.2015 SCH&BRD consistent, ERC:  errors(0), warnings(2) - only one pin on net NC(MH_DATA) and N$47  DRC: errors(7) 3x overlap via on IC8  4x overlap via on IC17
- do v5.91 tu bylo VBAT
- od v5.92 4.10.2016 3.3V
- UI-BOARD | RFTop-BOARD
- added R57
- 1uF->10uF
- Při 1M 300k 10nF trva spinaci dej 1,5ms tzn. max připojena kapacita 150uF pro Imax 1A dU/dT=10V/1,5ms
- 1,5ms je jen vlastni sepnuti, od zapnuti nohy PICA uplyne  3ms nez se zacne spinat a od vypnuti uplyne cca 15ms nez zacne vypinat!
- 0.35mA ->
- pri primem napajeni comparatoru 3,3V s rusením 70mV 17kHz comparatory nezakmitavaji,
- PSSR must be min 40dB/100kHz
- 0.35mA(1uA) -> | kdyz jsou 1 tak je ruseni samozrejme na vystupu videt ale nezakmitavaji
- aby nevadila pila 70mV na 3,3V
- tedy asi neni potreba RC clen R70 C68
- <-6uA | added C58,C59,C60
- zere 1mA!!! | 47R->300R
- 1uF->10uF
- <- 2x 0,6uA/3,3V
- Wait 2ms after AD ON
- originally  VPC_B was
- on this port RC14 | due to transient on IC1 REF2,5V
- Wait 100ms after AD OFF
- <-0,84mA if AVDD is REF
- before next AD ON
- ZVAZIT jestli na dalsi verzi nevyhodit operaky | <- 0,37mA if REF is AN10
- a misto nich dat High side fetem spinane delice  10k/2k+10nF ->0.75mA
- pokud se bude merit jen 1ms/1s  (podminkou je cista reference a +3,3V)
- O | I
- muze byt spotreba 0,75uA
- O | O
- druha varianta je osazeni nizkospotřebového pomaleho OAMPu
- např. MCP6041 0,6uA ale je nutny RC 3,3k/100n na výstupu a vyzkouset!!! | O | O
- 1,4uA/9V ->
- I/O | O
- power consuption MB5.8 standby
- VBAT>4,82V+/-0,03V
- it means IC2+IC7+IC5+IC11
- PSSR must be min 40dB/100kHz | O | I
- sleep 30uA/9V | toto spina velmi tvrde ale tady to vubec nevadi, ale nekopirovat to jinam
- idle LPRC31kHz 56uA/9V
- LPRC31kHz(working) 78uA/9V
- O | O | zmena FDC6324 -> FDC6330 ktery je na LAN ADAPT
- ext32kHz->SOSCI 72uA
- <- 0,25uA
- FRC 32Khz 285uA
- O | FRC 256Khz 340uA | I
- FRC 8Mhz 3,0mA/9V
- O | I | VBAT>6,80V+/-0,05V
- + standby UI board 128uA/9V
- VPC_B remaped from RC14 to  RD15/CN21/RP5/+5Vtolerant
- IC7 pwr cons =  22uA + 19% I input MB5.8
- RD15 was originaly XB_RTS | O | O
- UI7 efficiency 81% *  (Iin -27uA) / Iin
- VPC_A stay on RD9/CN54/RP4/+5Vtolerant
- 0.35mA -> | I | I/O
- vstupy PICa jsou 5V tolerant
- <- 0.35mA if REF ADC
- O | I
- O | I
- O
- I
- O
- zvazit hodnotu RC clenu zatim 2,5M/100n 250ms tzn. až 2s je ustálení | zmena na 1M tzn. 0,5M/100n 50ms tzn. 0.4s je ustálení
- O | O | 1,25V
- A
- I | O
- NA CO TO JE?
- O | O
- ZERE TO 30mA/9V
- I | O | LAN ADAPTER
- I | I | Cell modem extension
- Tady ma byt PullUp tak 1M
- I | O
- aby pri P.On  byl zavreny
- Do  gate by mel byt tak 1M
- I | O
- spina moc rychle, proud. pulz
- O | O
- O | O
- O | O | <-VBAT misto BATB
- O | I
- A
- A
- A | O
- Tady ma byt PullUp tak 1M
- aby pri P.On  byl zavreny
- A | O | Dat do serie odpor aby spinalo mekkce
- Do  gate by mel byt tak 1M
- spina moc rychle, proud. pulz
- O
- O | O | NA LAN ADAPT vypinatelny VBATLAN VBATMB VPSON
- I | O
- O | O
- O | O
- O
- I | O
- I | O
- byla tu síť 10k a z ní udělané 2x10k=20k -> zmena na 15k
- O
- O
- I/O
- O
- neni 18pF moc?
- O
- I | O
- Nejaka idikacni/blikaci  LED by se mozna hodila na desce | C22 U>5.35V | I | O | do v5.91 M25P16-VMN6P  4.10.2016
- v5.92  N25Q032A13ESC  4.10.2016 | oba PICAKY musi jet zaroven jinak si rvou velky produ do noh | TADY je tvrda propojka PROC?
- O | I/O | shorted on PCB
- I/O | O | (U1TX)
- O
- shorted on PCB | (U1RX) | I
- BATTERY A
- primary alcalic 20000mAh
- OR | AZ NA MB60
- spinace BATA A BATB spinaji dost tvrde, kterlo by je podrazit odporem a moznak nejaky kond na gate a mozna k vnitrni diode dat vnejsi schotkinu
- external power supply 12V
- PIC24FJ256GA110-I/PT
- NEJDE VYPNOUT OBE BATERIE posrane A_3VOFF a B_3VOFF | ZAPINANI VACT z BATA BATB se nahradi jednim spinacem z VBAT | PIC24FJ1024GA610-I/PT
- Diody netreba naopak pripadna rekuperace se ma kam vratit
- added EMI choke
- poznamka ke zdroji - mereni 1.2.2016
- Uin=12V
- I in ->
- zatez 3,6R 3,33V =>0.92A - hranice napetove regulace
- 150mV ACsin
- 0.1uF->1uF
- zatez 3,1R 3,05V =>0.98A - uz jede proudove
- AZ NA MB60 | zvazit jestli by neslo dat na 3,3V nejake nulove propojky - pro snazssi hledani chyb
- 1.8us ON 3.6us OFF (12V->3.33V)
- pri 33uH proud 0.8A->1.2A / 1.8us
- pri 33uH na 0.12R napeti 100mV-> 150mV / 1.8us
- => ZDROJ 3.3V/0.9A  (pri 0.12R 33uH)
- D1 Reverse current IR = 2,5nA/3,3V/25°C | Uf 82mV/125nA
- backup 2min
- added EMI choke
- sawtooth 70mV/1-100kHz
- added 1000uF
- 11.9.2015 rozpojeno
- recommended discharge <300uA
- IC7 power consuption =  22uA + 19% I in
- D11 by byl vhodneji az za R84
- efficiency 81% *  ( Iin -27uA) / I in
- 25.8.15 prida R98 300k na 3.3V od v5.91 | aby se 3.3V vybijelo do nuly
- Power consuption  PCF2123 is 125nA
- na v5.8 byl R56 pull down nyni spravne pull up | 1.6.15 v5.9 byl R56 zmenen na pull up
- Battery capacity CR1220 is 35mAh | Selftime is >20 years  Self discharge 1-5%/year
- neni 5pF malo?
- programovaci TP11 by byl lepsi
- BATTERY B
- 1.6.2015 v5.9  pridat RC FILTR 1R/2x47uF  a DC vazba je az R84
- dat mimo prostor LAN4.0
- rechargeable NiMH | otestovalo se to a zda se to dobre
- 200mAh or 2000mAh
- Vout= 1.23*(1+1.69/1M)
- Vout= 3.31V
- Actuator driver
- Nevim proc je tu byl predepsan 1uF na 25V
- ale uz tu zustal (v5.9-v5.91)
- Turn-on THR 6,3V max 6,8V
- Turn-off THR 5,5V max 6,0V
- old connection of solar panel
- Added PCB as Library component
- 140uA/9V/standby->
- 6-9V | Actuators
- BOTTOM
- celkova zatez na vsolar je 120k tzn. pri 3uA 0,35V ale s kazdymi 10°C se zdvojnasobuje leakage
- maximum rozumne na vsolar je tak 1-1,2V - nad to uz se otvira Q22-A | SEPIC Charger 6-12V -> 9-10V/60-240mA
- <-12-18uA/8V/25°C MBR0502 | <-3-4uA/8V/25°C RB060M
- 11.9.2015 D9=RB0606M v5.91
- added EMI choke | added EMI choke
- <-3uA/8V/25°C
- C37 je 1u/25/X5R proc? | C50 1u/16V-X7R mozno sjednotit
- 1uA/9V/standby->
- 1x10u->2x4u7
- 4x10K
- <-65uA(zmereno bez maleho PICa!!! to neni spravne)
- C49 0.1uF->4u7
- 8,53V@stanby-from-VSOLAR=9,00V/140uA | 8,87V@stanby-from-VSOLAR=9,00V/140uA
- <-6uA/9V
- IDS 0,01->1A / UGS=1.2->1.3V | <-68uA/9V
- IDS 150uA / UGS=0.68V
- PWM Current limit set to:
- pri 4,1-4,3V se pripojuje solar k VBAT | 4x1M
- 8,53V@stanby-from-VSOLAR=9,00V/140uA | PSSR must be min 40dB/100kHz
- SD/SS current 20-40uA if IN>2.5V | Imax=3.3V*(301/(301+3300)/0.1R=2.75A
- PSSR -35db/100kHz -80db/1kHz
- shorted on PCB
- SD/SS current 200-800uA if IN<2.5V | sawtooth 70mV/100kHz on VCC no problem | Imax=3.3V*(301/(301+4990)/0.1R=1.87A
- OUT is ready 60us after power on
- UGS=0,64V / IDS=8uA | eLock mainboard
- VCC is OK 5us after switch on
- there is DC 0,042V and
- sawtooth 1mV/1-100kHz
- musi byt +5V tolerant
- sneslo by to RC člen pro napájení
- Gain =58.8 | INA zere pry max 115uA kdyz je Vsens=0mV
- current feedbach is very slow
- BOJIM SE SAHAT NA ZPETNOU VAZBU NABIEJNI BATB | delay is >6us - SEPIC oscilating on 100-150kHz | ovsem pokud dam 270R 10u a zapnu 1x za 1s tak průměrna spotreba bude 30uA a setup 1tau je 2,7ms
- there is DC 3,3V and
- <-8,6uA/2,6V | ASI BY SLO DAT 0.5R a GAIN snizit | due to very high gain and GBWP=10Mhz
- sawtooth 70mV/1-100kHz
- a dat 1uF je asi nanic  1uF a 270R je 0,27ms tzn. 3,7kHz a utlum je cca 0,15 takze uplne na nic to neni | 5.92
- ALE SPIS VYMENIT NABIJECIHO BROUKA
- Revision history:
- ALE AZ NA MB60
- ZMENIT ODPORY 1M/4,99M A ASI PREPOJIT NA REF2,5V  REF=0,416V  Imin=-166mA( nabijeni) Imax=833mA(vybijeni)
- https://docs.google.com/spreadsheet/ccc?key=0AnMmEbru0gyacHBIUHFFSVFhd1pUQnNvVTlPOG5UVEE#gid=2
- PRIDAT blokovaci 100n KOND na delic 1M/4,99M
- NEBUDU S TIM NA TETO VERZI NIC DELAT
- 300k/1uF/300k:
- tONtime=120ms  max.dU/dt=4V/25ms  rise time 60ms  Uin=6-10V+10mF  Out 11R+4,7mF
- tOFFtime=500ms  fall time 160ms  Uin=6-10V+10mF  Out 11R+4,7mF | Podminky pouziti ON/OFF regulace:
- MB60 - zvazit koncepci konektoru
- FDG6303N   IDS/UGS 1-10uA/0,6-0,7V ISD<0,2uA/0,55V 90pA/0V 2,1nA/0,23V 220nA/0,55V  8uA/0,66V
- pokud bude zvlast konektor pro napajeni z adapteru | NA MB5.8 a nizsi:   Pokud je odber vyssi nez 10mA tak se musi vypnout nabijeni (jinak SC45 bude davat nedefinovany proud)
- SSM6P49NU  IGS/UGS  9,5nA/3,5V  20nA/5V 0,2uA/10V
- SSM6P49NU  IDS=0,1-1A/UGS=1,2-1,3V/UDS=3-15V | tak CBA spinac je zbytecny
- SSM6P49NU  RDSON=0,08/UGS=1,8V(max. by DSH 0,15)    RDSON=0,06/UGS=2,5V(max. by DSH 0,08) | a mozna by se ziskal prostor | NA MB5.9 Podminku stanovit silneji: Pokud je BATB pripojena tak nenabijim, na VBAT je velky kond a navic MB59 by mohl byt smart battery takze by nabijec mel naprosto nedefinovany proud
- NA MB6.0 musime vyresit nabijec korektne, omezujici proudovou zpetnou vazbu dame na high side nabijece a tim nebude tato zpetna vazba zaviset od  neznameho odberu z BATB

## Library data of the parts
B1 = Keystone:KEYSTONE500: Keystone500 holder for CR1220 Jara 14.5.2015
B2 = Keystone:EECRG0V224H: Supercap 220mF D10,5x6,5 RM10 3.6V 2000h 85°C the same package EECS0HD224H 220mF 5,5V D10,5 H6 RM10 1000h 70°C
C1-C23 C25 C27 C29 C31-C33 C35-C37 C40-C48 C50 C52-C60 C62-C68 C71-C73 C75-C78 = DISCRETE:C-0603
C24 C26 C34 C38 C39 C49 C51 C74 = DISCRETE:C-0805
C28 C30 = DISCRETE:C-1210: Capacitor 1210 3.2x2.5mm
C61 = DiscreteEsika:CE5/13
C69 C70 = SmdDisc:CT
D1 = InfineonTech-AON:BAS70-05: Diode Schottky 70mA, 70V
D2 D4 D6 = Littelfuse:P6SMB*: TVS Unidirectional 13.6V, 15.2-16.8V breakdown
D3 D10 = st-microelectronics-AOM:STPS0540Z: Schottky diode 0.4V@0.5A 40Vrr, low Irr
D5 = Fairchild-AON:BAT54S: Schottky diode dual 30V 200mA
D7 = Fairchild-AON:BZX84C: Diode Zener SOT23
D8 = DiodesInc-AON:BAT54BRW: DIODE SCHOTTKY 0.2A 30V ARR DL 30V SOT363
D9 = ONsemi-AON:MBR0520: Schottky diode 20V 0.5A
D11 = st-microelectronics-AOM:SMLVT3V3: TVS 600W 4.1 Breakdown
D12 = DiodesInc-AON:BZT52*: DIODE ZENER 12V 500MW SOD123
F1 F2 = Vishay-AON:MFU0805FF03000P100: FUSE 3.00A 0805 VFAST SMD
IC1 = Intersil-U:ISL60002: Precision Low power V ref. Iq=350nA Vout=2.5V
IC2 = Microchip-AON:PIC24FJ256GA110: PIC24FJ256GA110 High-Performance, 16-Bit PIC
IC3 = Micron-U:M25P16: 16Mbit low voltage SPI Flash
IC4 IC12 = Microchip-AON:MCP6022: OPAMP 10MHz 0.5mV ofs 1mA supply
IC5 = NXP-AOM:PCF2123: RTC chip low power
IC6 = NXP-AOM:LM75A: Digital temperature sensor and thermal watchdog - I2C, Pwr supp. 2.8 V to 5.5 V, Temp. range -55°C to +125°C, 11bit ADC, 3.5 µA in shutdown mode
IC7 = LinearTech-AON:LTC1771: Hi efficiency DCDC step down
IC8 = st-microelectronics-AOM:L6227: DMOS dual full bridge driver with PWM 2A, 0.7Ohm 52V
IC9 = TexasInstruments-AON:INA214: Current monitor, 100V/V gain
IC10 IC13 = Microchip-AON:24*: Serial EEPROM I2C
IC11 = Microchip-AON:PIC10F200T: IC MCU Flash 256B of FLASH
IC14 = Semtech-AOM:SC4503: IC BOOST SEPIC ADJ 1.4A TSOT23
IC15 = Microchip-AON:MCP6542: COMP 4us 3mV hyst
IC16 = Microchip-AON:MCP6042: OAMP 14kHz LowPower 0,6uA G=1 stable OutCapLoad 70p/50k 10n/10k RailToRail VSS+0,4V VDD-0,5V
IC17 = LinearTech-AON:LTC1955: Dual Smart Card interface with Serial control
J1 = Tyco-U:3-641215-4: CONN HEADER VERT 4POS .100 30AU
J2 = CON-pinHeader-AON:MA13-2
J4 J10 = CON-pinHeader-AON:MA05-1
J5 J6 J9 J11 J16 = Tyco-U:3-641215-2: header 2 pin 100mil spacing
J7 = CON-pinHeader-AON:MA08-2
J8 = CON-Hirose-AON:DF11-10DP-2DSA: CONN HEADER 10POS 2MM PCB GOLD
J14 J15 = Tyco-U:3-641215-5: Connector 5 pin 100 mil
J17 = C&K_Components-U:CCM03-3504LFT: CONN SMART CARD FIXED 8PIN SMD
L1 = Sumida-UT:CR75*: Inductor power, 27uH, 0.12R 1.3A, 33uH, 0.13R 1.2A
L2 = DISCRETE:L-0805-0R
L3 L5-L7 = DISCRETE:L-1206E
L4 = L-Coiltronics-AON:DRQ73: Inductor dual
PCB1 = elockMB:PCB-MB
Q1 Q4 Q10 Q12 Q13 Q16 Q18 Q23 = Fairchild-AON:FDG6303N: Dual N-channel digital FET 25V/0.5A 0.45Ohm
Q3 Q5 = Fairchild-AON:FDC6324: IC LOAD SWITCH INT 20VIN SSOT-6
Q6 Q8 Q9 Q14 Q15 Q17 Q22 = Toshiba-AON:SSM6P49: MOSFET P-CH DUAL 30V UDFN6, 4A, 20V
Q7 = Citizen:CM519
Q11 = Fairchild-AON:FDN352: MOSFET P 30V 1.3A 180mOhm@-10V
Q20 = TXC_Tech-U:7B: Crystal 5x3.2mm, 18pF+-30ppm
R1 R2 R7 R9 R14 R16 R20 R21 R25 R26 R36 R38 R42 R50 = Panasonic-AON:EXB-38: Resistor array 4x
R3-R6 R8 R10-R13 R15 R17 R19 R22 R24 R27-R33 R37 R39 R41 R44 R45 R47-R49 R51-R83 R85-R95 R98 = DISCRETE:R-0603
R18 R34 R35 R40 R46 R84 = DISCRETE:R-0805
R23 R43 = DISCRETE:R-0603-0R
TP1 TP2 TP5-TP12 = TESTPAD:ROUND_SMD: Generic round SMD testpad
TP3 TP4 = TESTPAD:DNP-TESTPOINT: Generic round SMD testpad
Z1 Z2 = technol:REF